# Altium schematic sheet Power_Measurement.SchDoc: =SheetTitle
size A4; SheetTitle: Power Measurement; DrawnBy: Samyar Sadat Akhavi; SheetNumber: 3; SheetTotal: 19
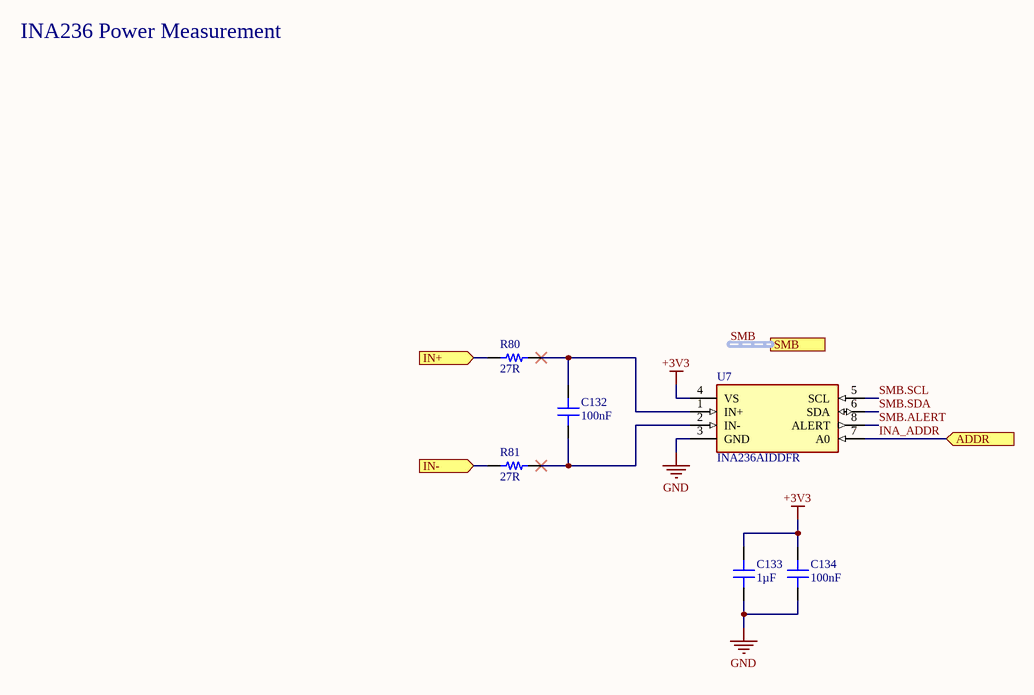
[diagram p0: Power_Measurement.SchDoc]

## Parts
?  (no value)  (graphical)
C132  100nF  [CAP 0603_1608]
C133  1µF  [CAP 0603_1608]
C134  100nF  [CAP 0603_1608]
R80  27R  [RES 0603_1608]
R81  27R  [RES 0603_1608]
U7  INA236AIDDFR  [SOT23-8_DDF_TEX]

## Ports
ADDR (in, see Voltage_Regulators[4D]), IN+ (in, see Voltage_Regulators[3D]), IN- (in, see Voltage_Regulators[3D]), SMB (harness SMBus, see Voltage_Regulators[4D], Battery_Input[4A], VBAT_Output[3B])

## Nets
+3V3: C133.2 C134.1 U7.4(VS)
GND: C133.1 C134.2 U7.3(GND)
IN+: R80.1 ; port IN+
IN-: R81.1 ; port IN-
INA_ADDR: U7.7(A0) ; port ADDR
SMB.ALERT: U7.8(ALERT)
SMB.SCL: U7.5(SCL)
SMB.SDA: U7.6(SDA)
NetC132_1: C132.1 R80.2 U7.1(IN+)
NetC132_2: C132.2 R81.2 U7.2(IN-)

## Buses and harness runs
harness SMB = port SMB

## Notes on the sheet
- INA236 Power Measurement
- Sub-Project:
- Size:
- Drawn By:
- Revision:
- Date:
- File:
- Sheet:
- of

## Library data of the parts
? = SGR-STDTBSA4: STANDARD SCHEMATICS TITLE BLOCK
C132 C134 = GEN-CC100NT10V50KX7R603: GENERIC 0603 MLC CAPACITOR; Tolerance: ±10%; Voltage: 50V; Dielectric: X7R; Part Number: GEN-CC100NT10V50KX7R603; Value: 100nF
C133 = GEN-CC1UT10V25KX7R603: GENERIC 0603 MLC CAPACITOR; Tolerance: ±10%; Voltage: 25V; Dielectric: X7R; Part Number: GEN-CC1UT10V25KX7R603; Value: 1µF
R80 R81 = GEN-CRR27T1P8603: GENERIC 0603 CHIP RESISTOR; Tolerance: ±1%; Power: 0.125W; Part Number: GEN-CRR27T1P8603; Value: 27R
U7 = INA236AIDDFR: IC CURRENT MON 0.015% TSOT23-8; Manufacturer: Texas Instruments; Copyright: Copyright (C) 2025 Ultra Librarian. All rights reserved.; Part Number: INA236AIDDFR; Supplier 1: DigiKey; Supplier Part Number 1: 296-INA236AIDDFRCT-ND